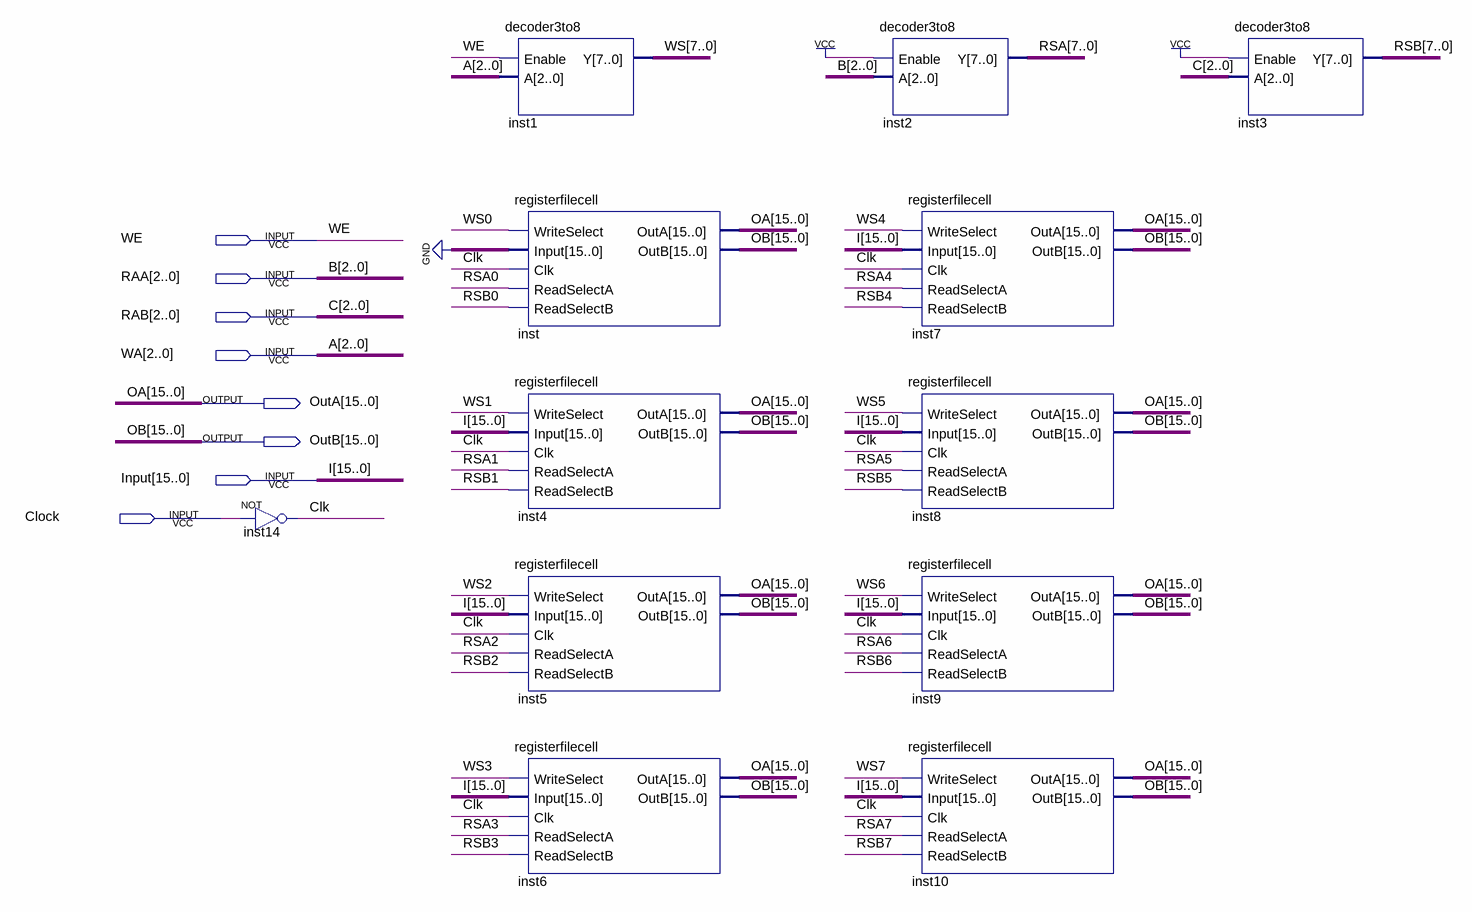
[diagram p0: schematic sheet]
// Quartus schematic registerfile8x16.bdf as structural Verilog: 12 symbols, 8 pins
module registerfile8x16 (
  input  WE,
  input  [2:0] RAA,
  input  [2:0] RAB,
  input  [2:0] WA,
  input  [15:0] Input,
  input  Clock,
  output [15:0] OutA,
  output [15:0] OutB
);

  wire Clk;
  wire [7:0] RSA, RSB, WS;

  not inst14 (Clk, Clock);
  decoder3to8 inst1 (.Enable(WE), .A(WA), .Y(WS));
  registerfilecell inst (
    .WriteSelect(WS[0]), .Input({16{1'b0}}), .Clk(Clk), .ReadSelectA(RSA[0]), .ReadSelectB(RSB[0]),
    .OutA(OutA), .OutB(OutB));
  registerfilecell inst4 (
    .WriteSelect(WS[1]), .Input(Input), .Clk(Clk), .ReadSelectA(RSA[1]), .ReadSelectB(RSB[1]), .OutA(OutA),
    .OutB(OutB));
  registerfilecell inst5 (
    .WriteSelect(WS[2]), .Input(Input), .Clk(Clk), .ReadSelectA(RSA[2]), .ReadSelectB(RSB[2]), .OutA(OutA),
    .OutB(OutB));
  registerfilecell inst6 (
    .WriteSelect(WS[3]), .Input(Input), .Clk(Clk), .ReadSelectA(RSA[3]), .ReadSelectB(RSB[3]), .OutA(OutA),
    .OutB(OutB));
  decoder3to8 inst2 (.Enable(1'b1), .A(RAA), .Y(RSA));
  registerfilecell inst7 (
    .WriteSelect(WS[4]), .Input(Input), .Clk(Clk), .ReadSelectA(RSA[4]), .ReadSelectB(RSB[4]), .OutA(OutA),
    .OutB(OutB));
  registerfilecell inst8 (
    .WriteSelect(WS[5]), .Input(Input), .Clk(Clk), .ReadSelectA(RSA[5]), .ReadSelectB(RSB[5]), .OutA(OutA),
    .OutB(OutB));
  registerfilecell inst9 (
    .WriteSelect(WS[6]), .Input(Input), .Clk(Clk), .ReadSelectA(RSA[6]), .ReadSelectB(RSB[6]), .OutA(OutA),
    .OutB(OutB));
  registerfilecell inst10 (
    .WriteSelect(WS[7]), .Input(Input), .Clk(Clk), .ReadSelectA(RSA[7]), .ReadSelectB(RSB[7]), .OutA(OutA),
    .OutB(OutB));
  decoder3to8 inst3 (.Enable(1'b1), .A(RAB), .Y(RSB));

  // Other names for the same wires on the sheet: A[2:0] = WA; B[2:0] = RAA; C[2:0] = RAB; I[15:0] = Input;
  //   OA[15:0] = OutA; OB[15:0] = OutB
endmodule
